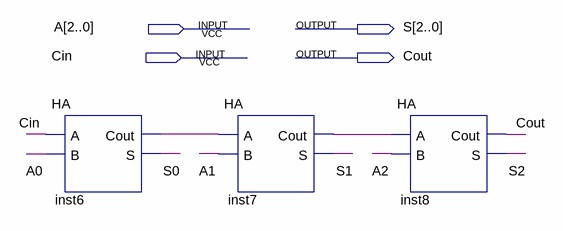
[diagram p0: schematic sheet]
// Quartus schematic INC3.bdf as structural Verilog: 3 symbols, 4 pins
module INC3 (
  input  [2:0] A,
  input  Cin,
  output [2:0] S,
  output Cout
);

  wire inst6_cout, inst7_cout;

  HA inst6 (.A(Cin), .B(A[0]), .Cout(inst6_cout), .S(S[0]));
  HA inst7 (.A(inst6_cout), .B(A[1]), .Cout(inst7_cout), .S(S[1]));
  HA inst8 (.A(inst7_cout), .B(A[2]), .Cout(Cout), .S(S[2]));
endmodule
